# Altium schematic sheet MZCAT_backlight_board.SchDoc
size 594 x 420 mm; SheetNumber: 1; SheetTotal: 1
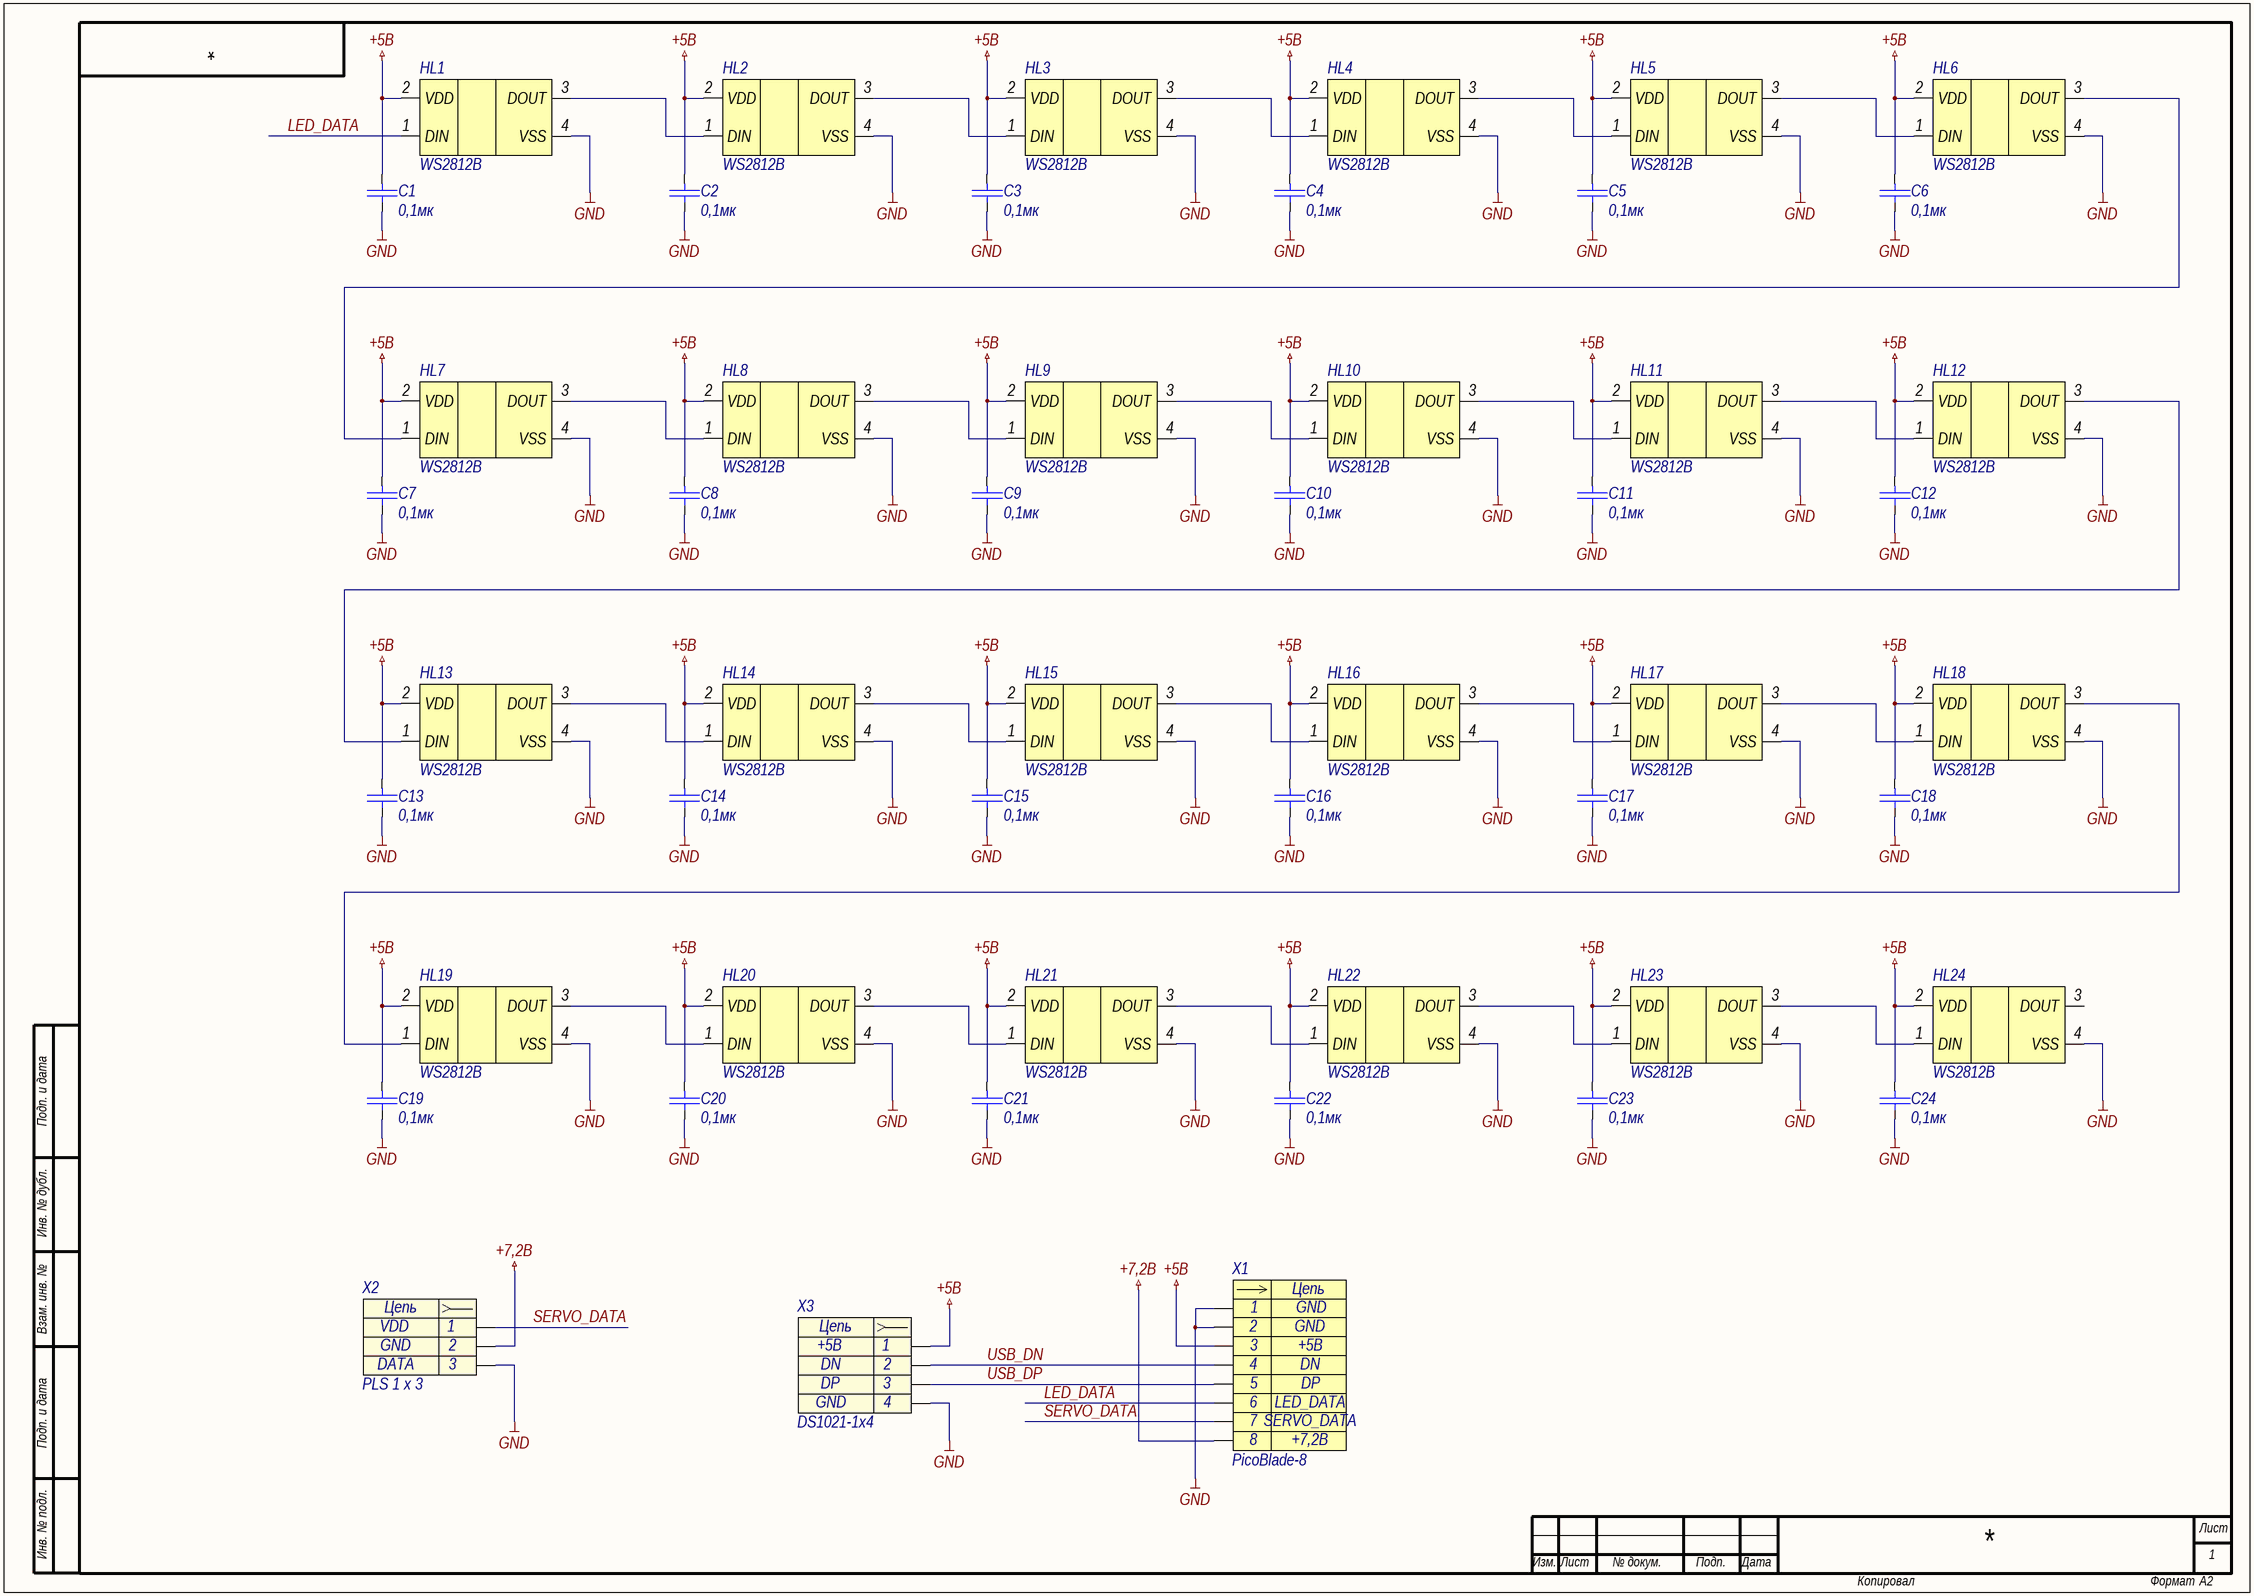
[diagram p0: MZCAT_backlight_board.SchDoc]

## Parts
HL1  WS2812B  [ws2812b 4020]
HL2  WS2812B  [ws2812b 4020]
HL3  WS2812B  [ws2812b 4020]
HL4  WS2812B  [ws2812b 4020]
HL5  WS2812B  [ws2812b 4020]
HL6  WS2812B  [ws2812b 4020]
HL7  WS2812B  [ws2812b 4020]
HL8  WS2812B  [ws2812b 4020]
HL9  WS2812B  [ws2812b 4020]
HL10  WS2812B  [ws2812b 4020]
HL11  WS2812B  [ws2812b 4020]
HL12  WS2812B  [ws2812b 4020]
HL13  WS2812B  [ws2812b 4020]
HL14  WS2812B  [ws2812b 4020]
HL15  WS2812B  [ws2812b 4020]
HL16  WS2812B  [ws2812b 4020]
HL17  WS2812B  [ws2812b 4020]
HL18  WS2812B  [ws2812b 4020]
HL19  WS2812B  [ws2812b 4020]
HL20  WS2812B  [ws2812b 4020]
HL21  WS2812B  [ws2812b 4020]
HL22  WS2812B  [ws2812b 4020]
HL23  WS2812B  [ws2812b 4020]
HL24  WS2812B  [ws2812b 4020]
X1  PicoBlade-8  [PicoBlade-8 SMD]
X2  PLS 1 x 3  [PLS_1x3 - emty]
X3  DS1021-1x4  [PLS_1x4 - emty]
С1  0,1мк  [C0402]
С2  0,1мк  [C0402]
С3  0,1мк  [C0402]
С4  0,1мк  [C0402]
С5  0,1мк  [C0402]
С6  0,1мк  [C0402]
С7  0,1мк  [C0402]
С8  0,1мк  [C0402]
С9  0,1мк  [C0402]
С10  0,1мк  [C0402]
С11  0,1мк  [C0402]
С12  0,1мк  [C0402]
С13  0,1мк  [C0402]
С14  0,1мк  [C0402]
С15  0,1мк  [C0402]
С16  0,1мк  [C0402]
С17  0,1мк  [C0402]
С18  0,1мк  [C0402]
С19  0,1мк  [C0402]
С20  0,1мк  [C0402]
С21  0,1мк  [C0402]
С22  0,1мк  [C0402]
С23  0,1мк  [C0402]
С24  0,1мк  [C0402]

## Nets
+5В: HL1.2(VDD) HL2.2(VDD) HL3.2(VDD) HL4.2(VDD) HL5.2(VDD) HL6.2(VDD) HL7.2(VDD) HL8.2(VDD) HL9.2(VDD) HL10.2(VDD) HL11.2(VDD) HL12.2(VDD) HL13.2(VDD) HL14.2(VDD) HL15.2(VDD) HL16.2(VDD) HL17.2(VDD) HL18.2(VDD) HL19.2(VDD) HL20.2(VDD) HL21.2(VDD) HL22.2(VDD) HL23.2(VDD) HL24.2(VDD) X1.3 X3.1 С1.2 С2.2 С3.2 С4.2 С5.2 С6.2 С7.2 С8.2 С9.2 С10.2 С11.2 С12.2 С13.2 С14.2 С15.2 С16.2 С17.2 С18.2 С19.2 С20.2 С21.2 С22.2 С23.2 С24.2
+7,2В: X1.8 X2.2
GND: HL1.4(VSS) HL2.4(VSS) HL3.4(VSS) HL4.4(VSS) HL5.4(VSS) HL6.4(VSS) HL7.4(VSS) HL8.4(VSS) HL9.4(VSS) HL10.4(VSS) HL11.4(VSS) HL12.4(VSS) HL13.4(VSS) HL14.4(VSS) HL15.4(VSS) HL16.4(VSS) HL17.4(VSS) HL18.4(VSS) HL19.4(VSS) HL20.4(VSS) HL21.4(VSS) HL22.4(VSS) HL23.4(VSS) HL24.4(VSS) X1.1 X1.2 X2.3 X3.4 С1.1 С2.1 С3.1 С4.1 С5.1 С6.1 С7.1 С8.1 С9.1 С10.1 С11.1 С12.1 С13.1 С14.1 С15.1 С16.1 С17.1 С18.1 С19.1 С20.1 С21.1 С22.1 С23.1 С24.1
LED_DATA: HL1.1(DIN) X1.6
SERVO_DATA: X1.7 X2.1
USB_DN: X1.4 X3.2
USB_DP: X1.5 X3.3
NetHL1_3: HL1.3(DOUT) HL2.1(DIN)
NetHL2_3: HL2.3(DOUT) HL3.1(DIN)
NetHL3_3: HL3.3(DOUT) HL4.1(DIN)
NetHL4_3: HL4.3(DOUT) HL5.1(DIN)
NetHL5_3: HL5.3(DOUT) HL6.1(DIN)
NetHL6_3: HL6.3(DOUT) HL7.1(DIN)
NetHL7_3: HL7.3(DOUT) HL8.1(DIN)
NetHL8_3: HL8.3(DOUT) HL9.1(DIN)
NetHL9_3: HL9.3(DOUT) HL10.1(DIN)
NetHL10_3: HL10.3(DOUT) HL11.1(DIN)
NetHL11_3: HL11.3(DOUT) HL12.1(DIN)
NetHL12_3: HL12.3(DOUT) HL13.1(DIN)
NetHL13_3: HL13.3(DOUT) HL14.1(DIN)
NetHL14_3: HL14.3(DOUT) HL15.1(DIN)
NetHL15_3: HL15.3(DOUT) HL16.1(DIN)
NetHL16_3: HL16.3(DOUT) HL17.1(DIN)
NetHL17_3: HL17.3(DOUT) HL18.1(DIN)
NetHL18_3: HL18.3(DOUT) HL19.1(DIN)
NetHL19_3: HL19.3(DOUT) HL20.1(DIN)
NetHL20_3: HL20.3(DOUT) HL21.1(DIN)
NetHL21_3: HL21.3(DOUT) HL22.1(DIN)
NetHL22_3: HL22.3(DOUT) HL23.1(DIN)
NetHL23_3: HL23.3(DOUT) HL24.1(DIN)

Not connected (* = marked no-connect by the designer): HL24 3(DOUT)

## Notes on the sheet
- Подп. и дата
- Инв. № дубл.
- Взам. инв. №
- Инв. № подл.
- Лист
- Изм.
- № докум.
- Подп.
- Дата
- Копировал
- Формат
- А2
- (in symbol Header_8) Цепь
- (in symbol PLS 1 x 3) Цепь
- (in symbol PLS 1 x 4) Цепь

## Library data of the parts
HL1-HL24 = WS2812B: адресный светодиод на микросхеме WS2812b; Name: WS2812B
X1 = Header_8: Разъем - 8 конт. мама; Contact_1: GND; Contact_3: +5В; Contact_4: DN; Contact_5: DP; Contact_6: LED_DATA; Contact_7: SERVO_DATA; Contact_8: +7,2В; Contact_2: GND; Name: PicoBlade-8
X2 = PLS 1 x 3: Contact_1: VDD; Contact_2: GND; Contact_3: DATA; Name: PLS 1 x 3
X3 = PLS 1 x 4: Contact_1: +5В; Contact_2: DN; Contact_3: DP; Contact_4: GND; Name: DS1021-1x4
С1-С24 = Кер. конденсатор: Value: 0,1мк